# EAGLE design SaLFrostburn (EAGLE 7.5.0)
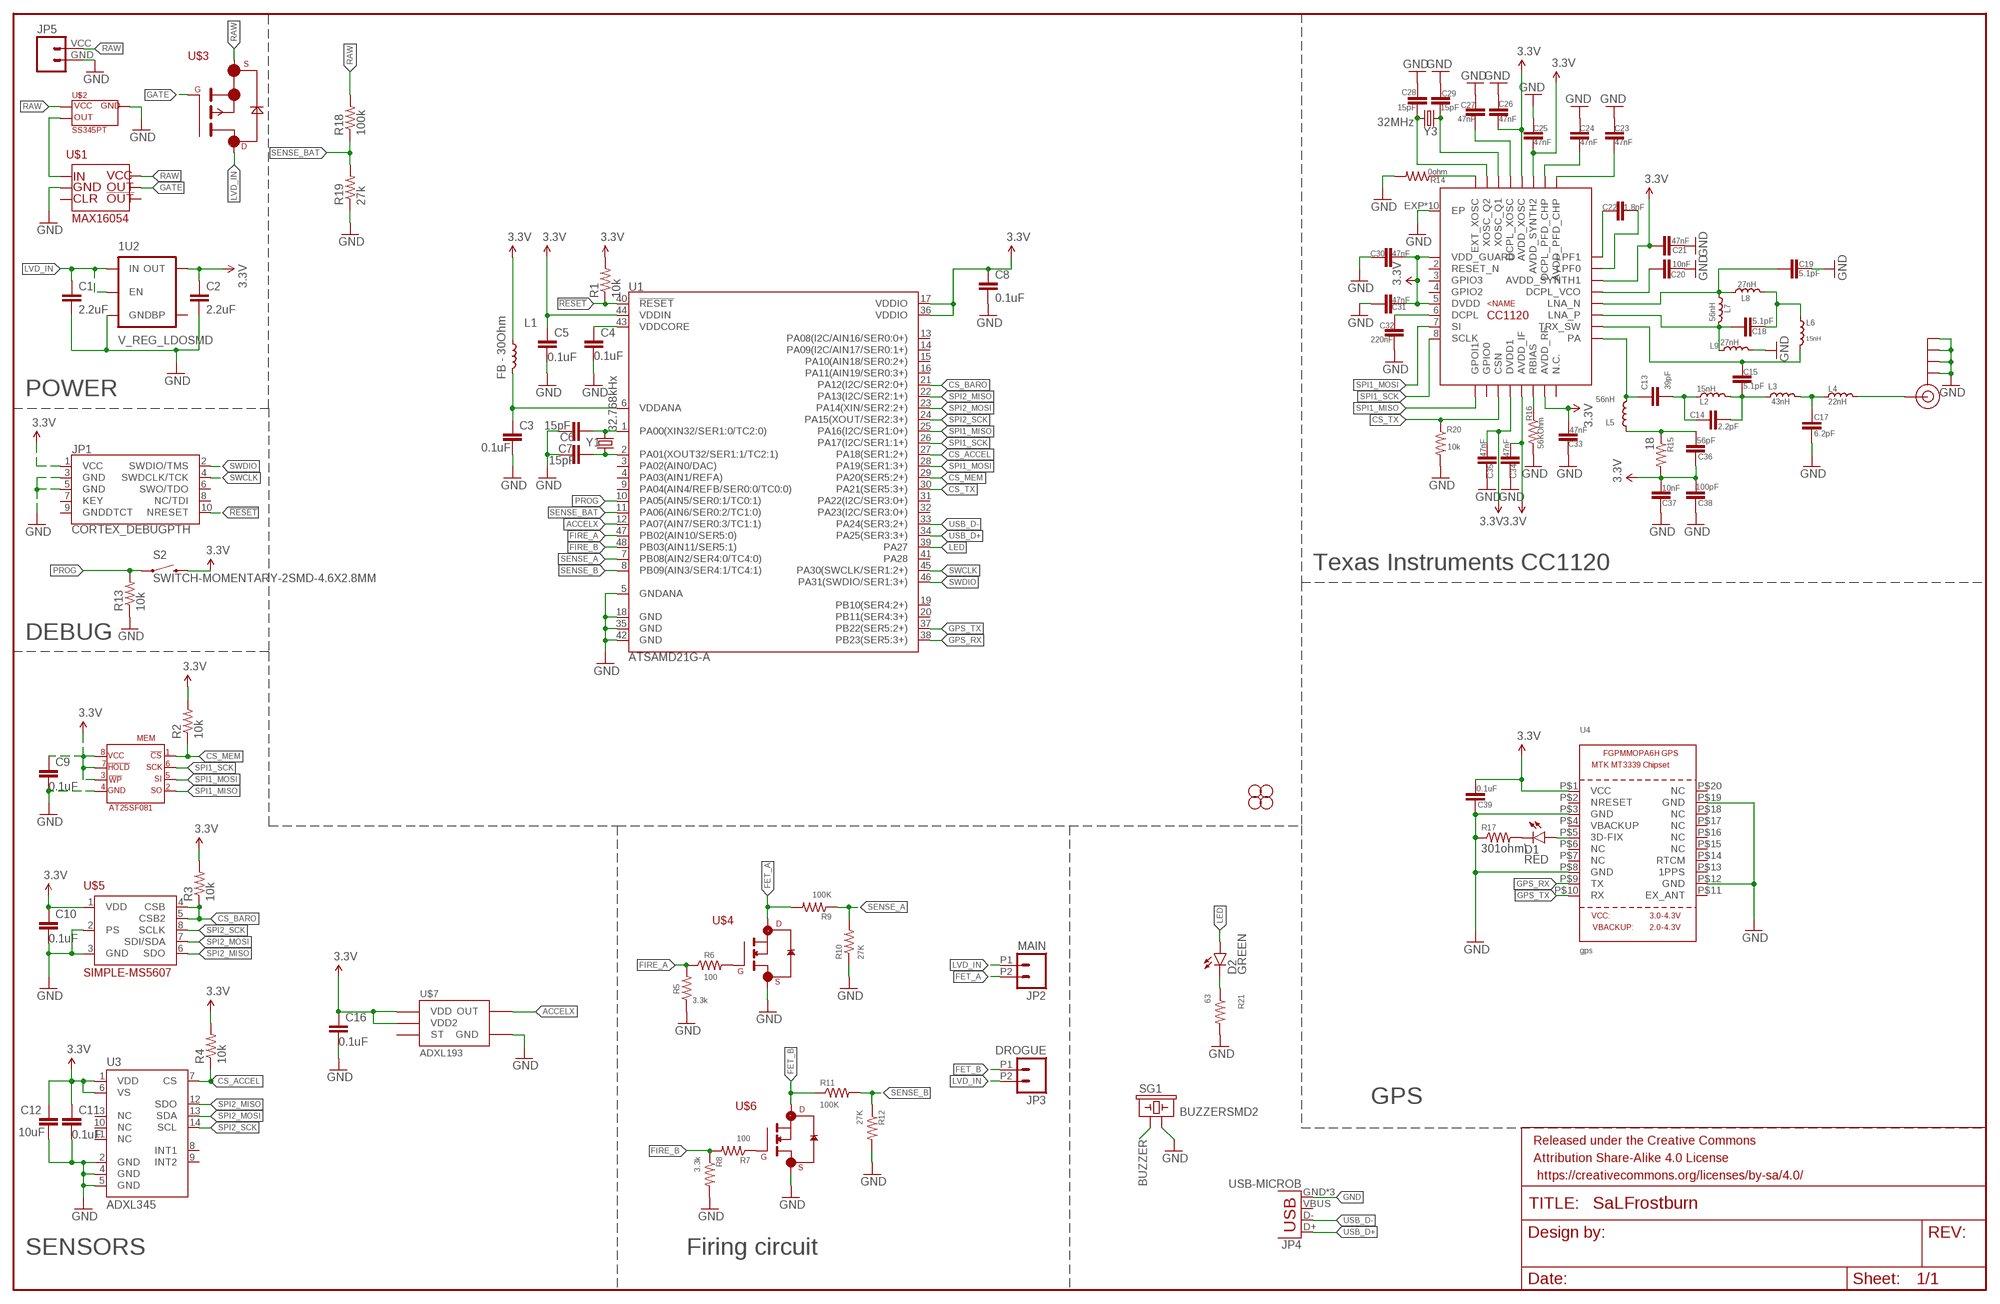
[diagram p0: schematic, sheet 1]

## Parts
1U2  V_REG_LDOSMD  [SOT23-5]
C1  2.2uF  CAP0603-CAP  [0603-CAP]
C2  2.2uF  CAP0603-CAP  [0603-CAP]
C3  0.1uF  CAP0402-CAP  [0402-CAP]
C4  0.1uF  CAP0402-CAP  [0402-CAP]
C5  0.1uF  CAP0402-CAP  [0402-CAP]
C6  15pF  CAP0402-CAP  [0402-CAP]
C7  15pF  CAP0402-CAP  [0402-CAP]
C8  0.1uF  CAP0402-CAP  [0402-CAP]
C9  0.1uF  CAP0402-CAP  [0402-CAP]
C10  0.1uF  CAP0402-CAP  [0402-CAP]
C11  0.1uF  CAP0402-CAP  [0402-CAP]
C12  10uF  CAP0402-CAP  [0402-CAP]
C13  39pF  CAP0402-CAP  [0402-CAP]
C14  2.2pF  CAP0402-CAP  [0402-CAP]
C15  5.1pF  CAP0402-CAP  [0402-CAP]
C16  0.1uF  CAP0402-CAP  [0402-CAP]
C17  6.2pF  CAP0402-CAP  [0402-CAP]
C18  5.1pF  CAP0402-CAP  [0402-CAP]
C19  5.1pF  CAP0402-CAP  [0402-CAP]
C20  10nF  CAP0402-CAP  [0402-CAP]
C21  47nF  CAP0402-CAP  [0402-CAP]
C22  1.8nF  CAP0402-CAP  [0402-CAP]
C23  47nF  CAP0402-CAP  [0402-CAP]
C24  47nF  CAP0402-CAP  [0402-CAP]
C25  47nF  CAP0402-CAP  [0402-CAP]
C26  47nF  CAP0402-CAP  [0402-CAP]
C27  47nF  CAP0402-CAP  [0402-CAP]
C28  15pF  CAP0402-CAP  [0402-CAP]
C29  15pF  CAP0402-CAP  [0402-CAP]
C30  47nF  CAP0402-CAP  [0402-CAP]
C31  47nF  CAP0402-CAP  [0402-CAP]
C32  220nF  CAP0402-CAP  [0402-CAP]
C33  47nF  CAP0402-CAP  [0402-CAP]
C34  47nF  CAP0402-CAP  [0402-CAP]
C35  47nF  CAP0402-CAP  [0402-CAP]
C36  56pF  CAP0402-CAP  [0402-CAP]
C37  10nF  CAP0402-CAP  [0402-CAP]
C38  100pF  CAP0402-CAP  [0402-CAP]
C39  0.1uF  CAP0402-CAP  [0402-CAP]
D1  RED  LED-RED0603  [LED-0603]
D2  GREEN  LED-GREEN1206  [LED-1206]
FRAME1  FRAME-LEDGER  [CREATIVE_COMMONS]
J$1  SMA_EDGE  [SMA-EDGE]
JP1  CORTEX_DEBUGPTH  [2X5-PTH-1.27MM]
JP2  MAIN  M022.54MM_SCREWTERM  [1X02_2.54_SCREWTERM]
JP3  DROGUE  M022.54MM_SCREWTERM  [1X02_2.54_SCREWTERM]
JP4  USB-MICROB  [USB-MICROB]
JP5  M024UCON-15767  [JST-2-SMD-VERT]
L1  FB - 30Ohm  INDUCTOR0603  [0603]
L2  15nH  INDUCTOR0402  [C0402]
L3  43nH  INDUCTOR0402  [C0402]
L4  22nH  INDUCTOR0402  [C0402]
L5  56nH  INDUCTOR0402  [C0402]
L6  15nH  INDUCTOR0402  [C0402]
L7  56nH  INDUCTOR0402  [C0402]
L8  27nH  INDUCTOR0402  [C0402]
L9  27nH  INDUCTOR0402  [C0402]
MEM  AT25SF081  [AT25SF081]
R1  10k  RESISTOR0402-RES  [0402-RES]
R2  10k  RESISTOR0402-RES  [0402-RES]
R3  10k  RESISTOR0402-RES  [0402-RES]
R4  10k  RESISTOR0402-RES  [0402-RES]
R5  3.3k  RESISTOR0402  [0402-RES]
R6  100  RESISTOR0402  [0402-RES]
R7  100  RESISTOR0402  [0402-RES]
R8  3.3k  RESISTOR0402  [0402-RES]
R9  100K  RESISTOR0402  [0402-RES]
R10  27K  RESISTOR0402  [0402-RES]
R11  100K  RESISTOR0402  [0402-RES]
R12  27K  RESISTOR0402  [0402-RES]
R13  10k  RESISTOR0402-RES  [0402-RES]
R14  0ohm  RESISTOR0402-RES  [0402-RES]
R15  18  RESISTOR0402-RES  [0402-RES]
R16  56KOhm  RESISTOR0402-RES  [0402-RES]
R17  301ohm\  RESISTOR0402-RES  [0402-RES]
R18  100k  RESISTOR0402-RES  [0402-RES]
R19  27k  RESISTOR0402-RES  [0402-RES]
R20  10k  RESISTOR0402-RES  [0402-RES]
R21  63  RESISTOR0402  [0402-RES]
S2  SWITCH-MOMENTARY-2SMD-4.6X2.8MM  [TACTILE_SWITCH_SMD_4.6X2.8MM]
SG1  BUZZERSMD2  [BUZZER-CCV]
STANDOFF1  STAND-OFF  [STAND-OFF]
STANDOFF2  STAND-OFF  [STAND-OFF]
STANDOFF3  STAND-OFF  [STAND-OFF]
STANDOFF4  STAND-OFF  [STAND-OFF]
TX/RX  CC1120  [CC1120]
U1  ATSAMD21G-A  [TQFP-48]
U3  ADXL345  [LGA14]
U4  gps  GPS_FGPMMOPA6H  [FGPMMOPA6H]
U$1  MAX16054  [MAX16054]
U$2  SS345PT  [SS345PT]
U$3  SI7615ADN  [SI7615ADN]
U$4  SIS410DN  [POWERPACK1212-8]
U$5  SIMPLE-MS5607  [MS5607]
U$6  SIS410DN  [POWERPACK1212-8]
U$7  ADXL193  [ADXL193]
Y1  32.768kHx  CRYSTAL3.2X1.5MM  [CRYSTAL-SMD-3.2X1.5MM]
Y3  32MHz  CRYSTAL5X3  [CRYSTAL-SMD-5X3]

## Nets
3.3V: 1U2.5(OUT) C2.1 C5.1 C8.1 C9.1 C10.1 C11.1 C12.1 C16.1 C21.1 C25.2 C26.2 C30.2 C31.2 C33.2 C34.2 C35.2 C36.1 C37.2 C38.2 C39.2 JP1.1(VCC) L1.1 MEM.!HOLD MEM.!WP MEM.VCC R1.2 R2.2 R3.2 R4.2 R15.2 S2.3 S2.4 TX/RX.1(VDD_GUARD) TX/RX.5(DVDD) TX/RX.12(DVDD1) TX/RX.13(AVDD_IF) TX/RX.15(AVDD_RF) TX/RX.22(AVDD_SYNTH1) TX/RX.27(AVDD_SYNTH2) TX/RX.28(AVDD_XOSC) U1.17(VDDIO) U1.36(VDDIO) U1.44(VDDIN) U3.1(VDD) U3.6(VS) U4.P$1(VCC) U$5.1(VDD) U$7.P$7(VDD) U$7.P$8(VDD2)
!RESET: JP1.10(NRESET) R1.1 U1.40(!RESET!)
ACCELX: U1.12(PA07(AIN7/SER0:3/TC1:1)) U$7.P$6(OUT)
BUZZER: SG1.+
CS_ACCEL: R4.1 U1.27(PA18(SER1:2+)) U3.7(CS)
CS_BARO: R3.1 U1.21(PA12(I2C/SER2:0+)) U$5.4(CSB) U$5.5(CSB2)
CS_MEM: MEM.!CS R2.1 U1.29(PA20(SER5:2+))
CS_TX: R20.1 TX/RX.11(CSN) U1.30(PA21(SER5:3+))
FET_A: JP2.P2 R9.2 U$4.5(D) U$4.6(D) U$4.7(D) U$4.8(D)
FET_B: JP3.P1 R11.1 U$6.5(D) U$6.6(D) U$6.7(D) U$6.8(D)
FIRE_A: R5.2 R6.1 U1.47(PB02(AIN10/SER5:0))
FIRE_B: R7.2 R8.1 U1.48(PB03(AIN11/SER5:1))
GATE: U$1.OUT U$3.G
GND: 1U2.2(GND) C1.2 C2.2 C3.2 C4.2 C5.2 C6.2 C7.2 C8.2 C9.2 C10.2 C11.2 C12.2 C16.2 C17.2 C19.2 C20.2 C21.2 C23.1 C24.1 C25.1 C26.1 C27.1 C28.1 C29.1 C30.1 C31.1 C32.1 C33.1 C34.1 C35.1 C37.1 C38.1 C39.1 J$1.GND@0(GND) J$1.GND@1(GND) J$1.GND@2(GND) J$1.GND@3(GND) JP1.3(GND) JP1.5(GND) JP4.GND JP4.MT1(GND) JP4.MT2(GND) JP5.GND L9.2 MEM.GND R5.1 R8.2 R10.1 R12.2 R13.1 R14.2 R16.2 R17.1 R19.1 R20.2 R21.2 SG1.- TX/RX.EXP(EP) TX/RX.EXP@1(EP) TX/RX.EXP@2(EP) TX/RX.EXP@3(EP) TX/RX.EXP@4(EP) TX/RX.EXP@5(EP) TX/RX.EXP@6(EP) TX/RX.EXP@7(EP) TX/RX.EXP@8(EP) TX/RX.EXP@9(EP) U1.5(GNDANA) U1.18(GND) U1.35(GND) U1.42(GND) U3.2(GND) U3.4(GND) U3.5(GND) U4.P$3(GND) U4.P$8(GND) U4.P$12(GND) U4.P$19(GND) U$1.GND U$2.GND U$4.1(S) U$4.2(S) U$4.3(S) U$5.2(PS) U$5.3(GND) U$6.1(S) U$6.2(S) U$6.3(S) U$7.P$3(GND)
GPS_RX: U1.38(PB23(SER5:3+)) U4.P$9(TX)
GPS_TX: U1.37(PB22(SER5:2+)) U4.P$10(RX)
LED: D2.A U1.39(PA27)
LVD_IN: 1U2.1(IN) 1U2.3(EN) C1.1 JP2.P1 JP3.P2 U$3.D1(D) U$3.D2(D) U$3.D3(D) U$3.D4(D)
N$1: R6.2 U$4.4(G)
N$2: U$1.IN U$2.OUT
N$3: C6.1 U1.1(PA00(XIN32/SER1:0/TC2:0)) Y1.P$2
N$4: C7.1 U1.2(PA01(XOUT32/SER1:1/TC2:1)) Y1.P$1
N$5: C3.1 L1.2 U1.6(VDDANA)
N$6: C4.1 U1.43(VDDCORE)
N$8: R7.1 U$6.4(G)
N$9: C13.1 L5.2 TX/RX.17(PA)
N$10: C13.2 C14.1 L2.1
N$11: C14.2 C15.1 L2.2 L3.1
N$12: C17.1 L3.2 L4.1
N$13: J$1.SIG(SIGNAL) L4.2
N$15: C23.2 TX/RX.25(AVDD_PFD_CHP)
N$16: C15.2 L6.2 TX/RX.18(TRX_SW)
N$17: C18.1 L7.2 L9.1 TX/RX.19(LNA_P)
N$18: C18.2 L6.1 L8.2
N$19: C19.1 L7.1 L8.1 TX/RX.20(LNA_N)
N$20: C22.1 TX/RX.24(LPF1)
N$21: C22.2 TX/RX.23(LPF0)
N$22: C20.1 TX/RX.21(DCPL_VCO)
N$23: C24.2 TX/RX.26(DCPL_PFD_CHP)
N$24: R16.1 TX/RX.14(RBIAS)
N$25: R14.1 TX/RX.32(EXT_XOSC)
N$26: C27.2 TX/RX.29(DCPL_XOSC)
N$27: C29.2 TX/RX.30(XOSC_Q1) Y3.3
N$28: C28.2 TX/RX.31(XOSC_Q2) Y3.1
N$29: D2.C R21.1
N$30: D1.C R17.2
N$31: D1.A U4.P$5(3D-FIX)
N$34: C32.2 TX/RX.6(DCPL)
N$38: C36.2 L5.1 R15.1
PROG: R13.2 S2.1 S2.2 U1.10(PA05(AIN5/SER0:1/TC0:1))
RAW: JP5.VCC R18.2 U$1.VCC U$2.VCC U$3.S1(S) U$3.S2(S) U$3.S3(S)
SENSE_A: R9.1 R10.2 U1.7(PB08(AIN2/SER4:0/TC4:0))
SENSE_B: R11.2 R12.1 U1.8(PB09(AIN3/SER4:1/TC4:1))
SENSE_BAT: R18.1 R19.2 U1.11(PA06(AIN6/SER0:2/TC1:0))
SPI1_MISO: MEM.SO TX/RX.9(GPOI1) U1.25(PA16(I2C/SER1:0+))
SPI1_MOSI: MEM.SI TX/RX.7(SI) U1.28(PA19(SER1:3+))
SPI1_SCK: MEM.SCK TX/RX.8(SCLK) U1.26(PA17(I2C/SER1:1+))
SPI2_MISO: U1.22(PA13(I2C/SER2:1+)) U3.12(SDO) U$5.6(SDO)
SPI2_MOSI: U1.23(PA14(XIN/SER2:2+)) U3.13(SDA) U$5.7(SDI/SDA)
SPI2_SCK: U1.24(PA15(XOUT/SER2:3+)) U3.14(SCL) U$5.8(SCLK)
SWCLK: JP1.4(SWDCLK/TCK) U1.45(PA30(SWCLK/SER1:2+))
SWDIO: JP1.2(SWDIO/TMS) U1.46(PA31(SWDIO/SER1:3+))
USB_D+: JP4.D+ U1.34(PA25(SER3:3+))
USB_D-: JP4.D- U1.33(PA24(SER3:2+))
Unconnected: 1U2.4(BP) JP1.6(SWO/TDO) JP1.7(KEY) JP1.8(NC/TDI) JP1.9(GNDDTCT) JP4.VBUS TX/RX.2(RESET_N) TX/RX.3(GPIO3) TX/RX.4(GPIO2) TX/RX.10(GPIO0) TX/RX.16(N.C.) U1.3(PA02(AIN0/DAC)) U1.4(PA03(AIN1/REFA)) U1.9(PA04(AIN4/REFB/SER0:0/TC0:0)) U1.13(PA08(I2C/AIN16/SER0:0+)) U1.14(PA09(I2C/AIN17/SER0:1+)) U1.15(PA10(AIN18/SER0:2+)) U1.16(PA11(AIN19/SER0:3+)) U1.19(PB10(SER4:2+)) U1.20(PB11(SER4:3+)) U1.31(PA22(I2C/SER3:0+)) U1.32(PA23(I2C/SER3:0+)) U1.41(PA28) U3.3(NC) U3.8(INT1) U3.9(INT2) U3.10(NC) U3.11(NC) U4.P$2(NRESET) U4.P$4(VBACKUP) U4.P$6(NC) U4.P$7(NC) U4.P$11(EX_ANT) U4.P$13(1PPS) U4.P$14(RTCM) U4.P$15(NC) U4.P$16(NC) U4.P$17(NC) U4.P$18(NC) U4.P$20(NC) U$1.!OUT U$1.CLR U$7.P$4(ST)

## Notes on the sheet
- POWER
- Texas Instruments CC1120
- DEBUG
- GPS
- SENSORS | Firing circuit

## Library data of the parts
1U2 = SparkFun-PowerIC:V_REG_LDO: Voltage Regulator LDO Standard 150mA LDO voltage regulator in SOT-23 layout. Micrel part MIC5205. BP (by-pass) pin is used to lower output noise with 470pF cap.
C1 C2 C13-C15 C17-C39 = SparkFun-Capacitors:CAP: Capacitor Standard 0603 ceramic capacitor, and 0.1" leaded capacitor.
C3-C12 C16 = SparkFun-Passives:CAP: Capacitor Standard 0603 ceramic capacitor, and 0.1" leaded capacitor.
D1 = SparkFun-LED:LED-RED: Assorted Red LEDs LilyPad 1206- DIO-09912 1206- DIO-00809 0603- DIO-00819 "SMART" means more efficient and expensive; PROD_ID: DIO-00819
D2 = SparkFun-LED:LED-GREEN: Various green LEDs Green LEDs used in SFE Production 0603- DIO-00821 LARGE- DIO-00862 LILYPAD- DIO-09910; PROD_ID: DIO-00862
FRAME1 = SparkFun-Aesthetics:FRAME-LEDGER: Schematic Frame Standard 11x14 US Ledger frame
J$1 = SparkFun-Connectors:SMA_EDGE: SMA Antenna Connector End launch SMA connector. The paste layer has been removed so that the connector can be hand soldered onto the board after reflow.
JP1 = SparkFun-Connectors:CORTEX_DEBUG: Cortex Debug Connector Datasheet <http://infocenter.arm.com/help/topic/com.arm.doc.faqs/attached/13634/cortex_debug_connectors.pdf>
JP2 JP3 JP5 = SparkFun-Connectors:M02: Standard 2-pin 0.1" header. Use with - straight break away headers ( PRT-00116) - right angle break away headers (PRT-00553) - swiss pins (PRT-00743) - machine pins (PRT-00117) - female headers (PRT-00115) Molex polarized connector foot print use with: PRT-08233 with associated crimp pins and housings. 2.54_SCREWTERM for use with PRT-10571. 3.5mm Screw Terminal footprints for PRT-08084 5mm Screw Terminal footprints for use with PRT-08432
JP4 = SparkFun-Connectors:USB: USB Connectors USB-B-PTH is fully proven SKU : PRT-00139/CONN-08278 USB-miniB is fully proven SKU : PRT-00587 USB-A-PCB is untested. USB-A-H is throughly reviewed, but untested. Spark Fun Electronics SKU : PRT-00437 USB-B-SMT is throughly reviewed, but untested. Needs silkscreen touching up. USB-A-S has not been used/tested USB-MB-H has not been used/tested USB-MICROB has been used. CONN-09505; PROD_ID: CONN-09505
L1-L9 = SparkFun-Passives:INDUCTOR: Inductors Basic Inductor/Choke - 0603 and 1206. Footprints are not proven and vary greatly between part numbers. INDUCTOR POWER 3.3UH 4.0A SMD 0.197" L x 0.197" W x 0.177" H (5.00mm x 5.00mm x 4.50mm)
MEM = SaL-lib:AT25SF081: AT25SF081 - 8M memory smd
R1-R4 R13-R20 = SparkFun-Passives:RESISTOR: Resistor Basic schematic elements and footprints for 0603, 1206, and PTH resistors.
R5-R12 R21 = SparkFun-Resistors:RESISTOR: Resistor Basic schematic elements and footprints for 0603, 1206, and PTH resistors.
S2 = SparkFun-Electromechanical:SWITCH-MOMENTARY-2: Various NO switches- pushbuttons, reed, etc; PROD_ID: SWCH-13065
SG1 = SparkFun-Electromechanical:BUZZER: Buzzer 12mm Spark Fun Electronics SKU : Comp-Buzzer
STANDOFF1-STANDOFF4 = SparkFun-Electromechanical:STAND-OFF: #4 Stand Off This is the mechanical footprint for a #4 phillips button head screw. Use the keepout ring to avoid running the screw head into surrounding components. SKU : PRT-00447
TX/RX = SaL-lib:CC1120
U1 = SparkFun-DigitalIC:ATSAMD21G: Atmel SAMD21G SMART ARM-Based Microcontroller The Atmel ® | SMART ™ SAM D21 is a series of low-power microcontrollers using the 32-bit ARM ® Cortex ® -M0+ processor, and ranging from 32- to 64-pins with up to 256KB Flash and 32KB of SRAM. The SAM D21 devices operate at a maximum frequency of 48MHz and reach 2.46 CoreMark/MHz. They are designed for simple and intuitive migration with identical peripheral modules, hex compatible code, identical linear address map and pin compatible migration paths between all devices in the product series. All devices include intelligent and flexible peripherals, Atmel Event System for inter-peripheral signaling, and support for capacitive touch button, slider and wheel user interfaces.; PROD_ID: IC-13064
U3 = SparkFun-Sensors:ADXL345: 3-axis SPI/I2C 2/4/8/16g accelerometer
U4 = adafruit:GPS_FGPMMOPA6H: GPS Module - MTK MT3339 Chipset, -165dBm sensitivity, 22 channels, 10Hz, auto-select external antenna options
U$1 = SaL-lib:MAX16054
U$2 = SaL-lib:SS345PT
U$3 = SaL-lib:SI7615ADN
U$4 U$6 = SaL-lib1:SIS410DN
U$5 = MS5607:SIMPLE
U$7 = SparkFun-Sensors:ADXL193: 250g accelerometer analog out
Y1 = SparkFun-FreqCtrl:CRYSTAL: Various standard crystals. Proven footprints.
Y3 = SparkFun-FreqCtrl:CRYSTAL: Various standard crystals. Proven footprints.; PROD_ID: XTAL-08218

## Board
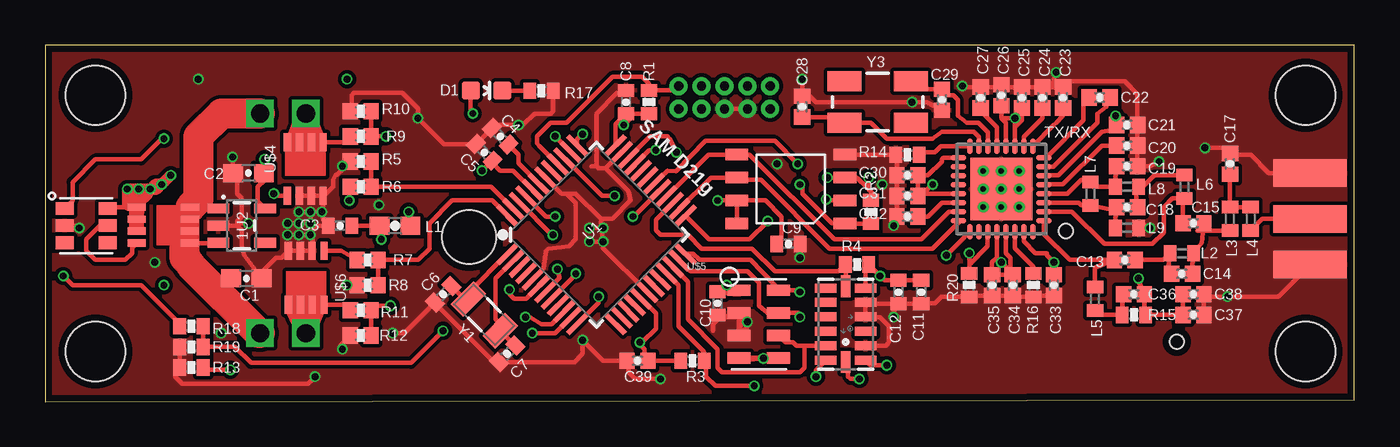
[diagram p1: board, top side]
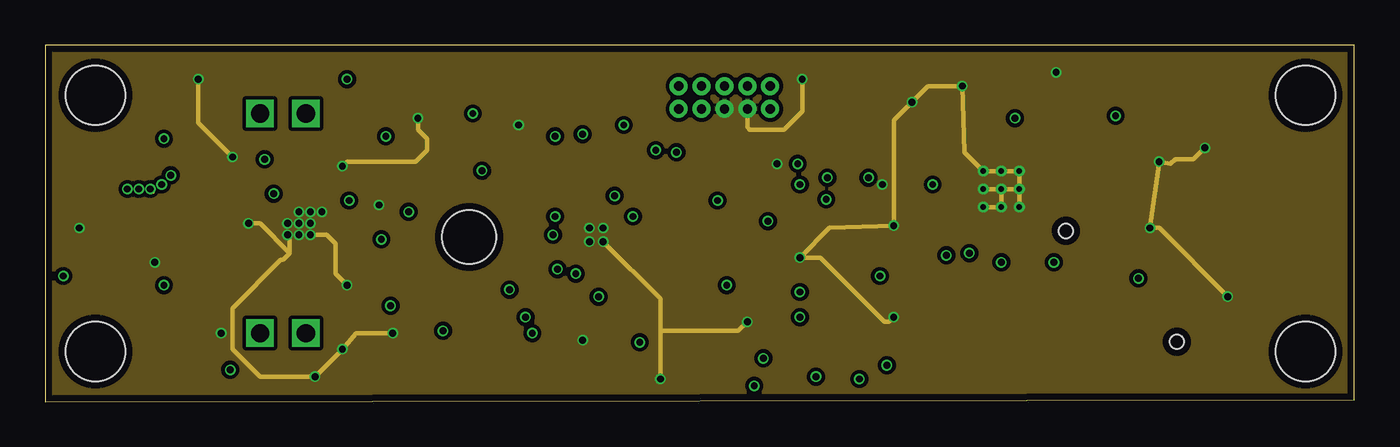
[diagram p2: board, inner layer Route2]
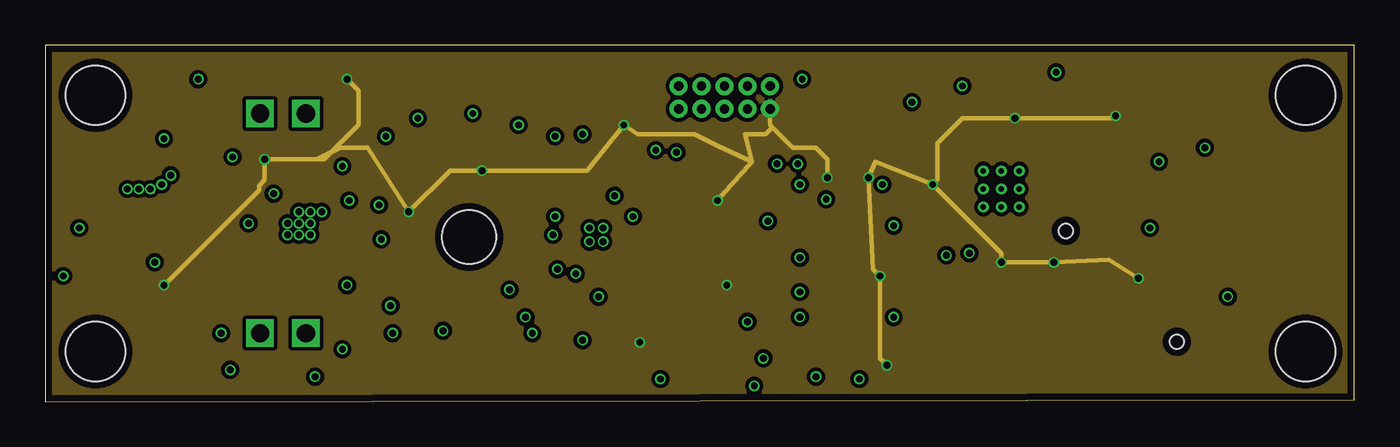
[diagram p3: board, inner layer Route15]
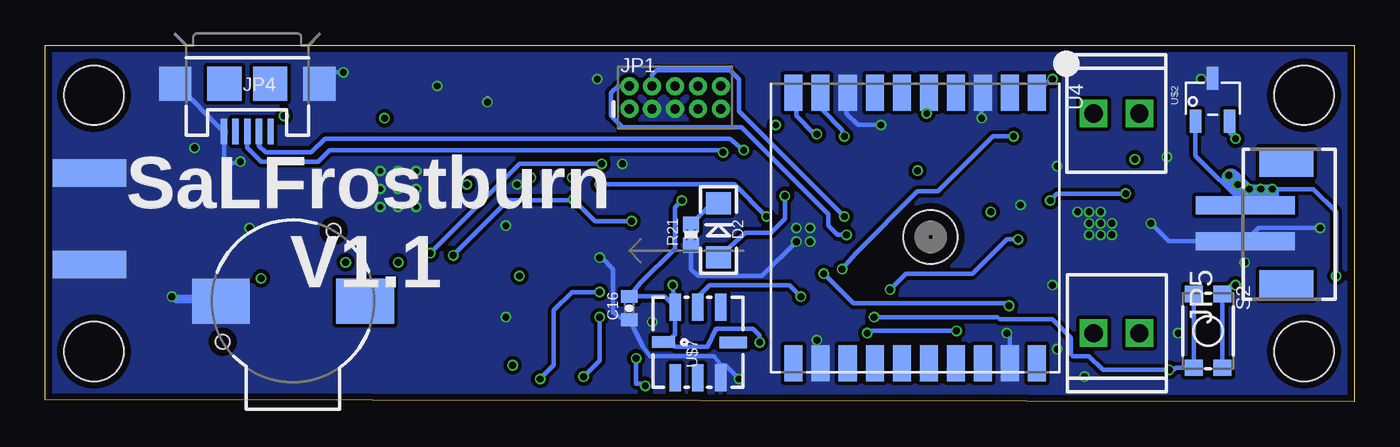
[diagram p4: board, bottom side, seen from below]

Size 72.69 x 19.8 mm. Coordinates in mm from the lower left corner, seen from the top.
Outline: 0,0 72.69,0.13 72.69,19.8 0,19.8 0,0
Copper layers (1*2*15*16): Top 0.035559375mm / dielectric 0.17018125mm / Route2 0.01778125mm / dielectric 47mil / Route15 0.01778125mm / dielectric 0.17018125mm / Bottom 0.035559375mm
Design rules "OSHPark-4layer-SaL *": minimum track width 5mil, minimum drill 10mil, track to track 8mil, track to pad 8mil, pad to pad 8mil, via to via 10mil, smd to smd 0mil, copper to edge 15mil, drill to drill 6mil, minimum pad ring 4mil, minimum via ring 4mil, stop-mask expansion 0mil, vias tented up to drill 20mil, thermal gap 0mil

### Footprints (pad centres in the part's own frame; a part is rotated, then mirrored left to right if it is on the bottom)
SOT23-5 = smd 0.55 x 1.2: 1 -0.95,-1.3; 2 0,-1.3; 3 0.95,-1.3; 4 0.95,1.3; 5 -0.95,1.3
0603-CAP = smd 1.1 x 1: 1 -0.85,0; 2 0.85,0
0402-CAP = smd 0.7 x 0.9: 1 -0.65,0; 2 0.65,0
0402-CAP' = smd 0.85 x 0.9: 1 -0.58,0; 2 0.58,0
LED-0603 = smd 1 x 1: A 0,-0.877; C 0,0.877
LED-1206 = smd 1.2 x 1.4: A -1.5,0; C 1.5,0
SMA-EDGE = smd 1.524 x 4.064: GND@0 0,0; GND@1 5.08,0; SIG 2.54,0 | smd 1.524 x 4.064 bottom: GND@2 0,0; GND@3 5.08,0
2X5-PTH-1.27MM = drill 0.508 pad 1: 1 -2.54,-0.635; 2 -2.54,0.635; 3 -1.27,-0.635; 4 -1.27,0.635; 5 0,-0.635; 6 0,0.635; 7 1.27,-0.635; 8 1.27,0.635; 9 2.54,-0.635; 10 2.54,0.635
1X02_2.54_SCREWTERM = drill 1.016 square: P1 2.54,0; P2 0,0
USB-MICROB = smd 0.35 x 1.4: D+ 0,2.65; D- -0.65,2.65; GND 1.3,2.65; ID 0.65,2.65; VBUS -1.3,2.65 | smd 1.8 x 1.9: MT1 -4,0; MT2 4,0 | smd 1.9 x 1.9: P$1 -1.27,0; P$2 1.27,0
JST-2-SMD-VERT = smd 1 x 5.5: GND 1,-2; VCC -1,-2 | smd 1.6 x 3: P$1 -3.4,0.27; P$2 3.4,0.27
0603 = smd 1.1 x 1: 1 -0.85,0; 2 0.85,0
C0402 = smd 0.7 x 0.9: 1 -0.65,0; 2 0.65,0
AT25SF081 = smd 1.27 x 0.635: !CS -3,2.54; !HOLD 3,1.27; !WP -3,0; GND -3,-1.27; SCK 3,0; SI 3,-1.27; SO -3,1.27; VCC 3,2.54
0402-RES = smd 0.7 x 0.9: 1 -0.65,0; 2 0.65,0
0402-RES' = smd 0.85 x 0.9: 1 -0.58,0; 2 0.58,0
TACTILE_SWITCH_SMD_4.6X2.8MM = smd 0.9 x 1: 1 -2.05,-0.8; 2 2.05,-0.8; 3 2.05,0.8; 4 -2.05,0.8
BUZZER-CCV = smd 3.2 x 2.5: + 4,0; - -4,0 | hole 0.8: -3.9,-2.25; 2.25,3.9
STAND-OFF = hole 3.302: 0,0
CC1120 = smd 0.85 x 0.3: 1 -2.375,1.75; 2 -2.375,1.25; 3 -2.375,0.75; 4 -2.375,0.25; 5 -2.375,-0.25; 6 -2.375,-0.75; 7 -2.375,-1.25; 8 -2.375,-1.75; 17 2.375,-1.75; 18 2.375,-1.25; 19 2.375,-0.75; 20 2.375,-0.25; 21 2.375,0.25; 22 2.375,0.75; 23 2.375,1.25; 24 2.375,1.75 | smd 0.3 x 0.85: 9 -1.75,-2.375; 10 -1.25,-2.375; 11 -0.75,-2.375; 12 -0.25,-2.375; 13 0.25,-2.375; 14 0.75,-2.375; 15 1.25,-2.375; 16 1.75,-2.375; 25 1.75,2.375; 26 1.25,2.375; 27 0.75,2.375; 28 0.25,2.375; 29 -0.25,2.375; 30 -0.75,2.375; 31 -1.25,2.375; 32 -1.75,2.375 | smd 3.45 x 3.45: EXP 0,0 | drill 0.3 pad 0.6: EXP@1 -1,1; EXP@2 0,1; EXP@3 1,1; EXP@4 -1,0; EXP@5 0,0; EXP@6 1,0; EXP@7 -1,-1; EXP@8 0,-1; EXP@9 1,-1
TQFP-48 = smd 1.5 x 0.28: 1 -4.25,2.75; 2 -4.25,2.25; 3 -4.25,1.75; 4 -4.25,1.25; 5 -4.25,0.75; 6 -4.25,0.25; 7 -4.25,-0.25; 8 -4.25,-0.75; 9 -4.25,-1.25; 10 -4.25,-1.75; 11 -4.25,-2.25; 12 -4.25,-2.75; 25 4.25,-2.75; 26 4.25,-2.25; 27 4.25,-1.75; 28 4.25,-1.25; 29 4.25,-0.75; 30 4.25,-0.25; 31 4.25,0.25; 32 4.25,0.75; 33 4.25,1.25; 34 4.25,1.75; 35 4.25,2.25; 36 4.25,2.75 | smd 0.28 x 1.5: 13 -2.75,-4.25; 14 -2.25,-4.25; 15 -1.75,-4.25; 16 -1.25,-4.25; 17 -0.75,-4.25; 18 -0.25,-4.25; 19 0.25,-4.25; 20 0.75,-4.25; 21 1.25,-4.25; 22 1.75,-4.25; 23 2.25,-4.25; 24 2.75,-4.25; 37 2.75,4.25; 38 2.25,4.25; 39 1.75,4.25; 40 1.25,4.25; 41 0.75,4.25; 42 0.25,4.25; 43 -0.25,4.25; 44 -0.75,4.25; 45 -1.25,4.25; 46 -1.75,4.25; 47 -2.25,4.25; 48 -2.75,4.25
LGA14 = smd 0.5 x 1.2: 1 2,1.1; 2 1.2,1.1; 3 0.4,1.1; 4 -0.4,1.1; 5 -1.2,1.1; 6 -2,1.1; 8 -2,-1.1; 9 -1.2,-1.1; 10 -0.4,-1.1; 11 0.4,-1.1; 12 1.2,-1.1; 13 2,-1.1 | smd 1.2 x 0.5: 7 -2.1,0; 14 2.1,0
FGPMMOPA6H = smd 2 x 1: P$1 -7.5,6.75; P$2 -7.5,5.25; P$3 -7.5,3.75; P$4 -7.5,2.25; P$5 -7.5,0.75; P$6 -7.5,-0.75; P$7 -7.5,-2.25; P$8 -7.5,-3.75; P$9 -7.5,-5.25; P$10 -7.5,-6.75; P$11 7.5,-6.75; P$12 7.5,-5.25; P$13 7.5,-3.75; P$14 7.5,-2.25; P$15 7.5,-0.75; P$16 7.5,0.75; P$17 7.5,2.25; P$18 7.5,3.75; P$19 7.5,5.25; P$20 7.5,6.75 | hole 3: 0.5,0.85
MAX16054 = smd 1 x 0.7: !OUT 1.2,-0.95; CLR -1.2,-0.95; GND -1.2,0; IN -1.2,0.95; OUT 1.2,0; VCC 1.2,0.95
SS345PT = smd 1.27 x 0.635: GND 1.2,0; OUT -1.2,-0.95; VCC -1.2,0.95
SI7615ADN = smd 0.99 x 0.405: D1 2.985,0; D2 2.985,-0.66; D3 2.985,-1.32; D4 2.985,-1.98; G 0,-1.98; S1 0,0; S2 0,-0.66; S3 0,-1.32
POWERPACK1212-8 = smd 0.99 x 0.405: 1 0,-1.98; 2 0,-1.32; 3 0,-0.66; 4 0,0; 5 2.985,0; 6 2.985,-0.66; 7 2.985,-1.32; 8 2.985,-1.98
MS5607 = smd 1.27 x 0.635: 1 -1.1,1.875; 2 -1.1,0.625; 3 -1.1,-0.625; 4 -1.1,-1.875; 5 1.1,-1.875; 6 1.1,-0.625; 7 1.1,0.625; 8 1.1,1.875
ADXL193 = smd 1.5 x 0.64: P$1 -1.96,1.26; P$2 -1.96,0; P$3 -1.96,-1.26; P$5 1.96,-1.26; P$6 1.96,0; P$7 1.96,1.26 | smd 0.64 x 1.5: P$4 0,-1.96 | smd 0.64 x 1.27: P$8 0.01,1.9
CRYSTAL-SMD-3.2X1.5MM = smd 1 x 1.8: P$1 -1.25,0; P$2 1.25,0
CRYSTAL-SMD-5X3 = smd 1.9 x 1.1: 1 -1.85,-1.15; 2 1.85,-1.15; 3 1.85,1.15; 4 -1.85,1.15

### Placement (x,y rotation side)
1U2  10.92,9.78 270 top
C1  11.18,6.86 0 top
C2  11.3,12.7 180 top
C3  16.38,9.78 180 top
C4  25.27,14.73 135 top
C5  24.38,13.84 135 top
C6  22.1,5.97 225 top
C7  25.65,2.67 225 top
C8  32.26,16.64 90 top
C9  41.27,8.76 0 top
C10  37.34,5.46 270 top
C11  48.64,6.1 270 top
C12  47.37,6.1 270 top
C13  39pF  [0402-CAP']  59.94,7.87 0 top
C14  2.2pF  [0402-CAP']  63.12,7.11 0 top
C15  5.1pF  [0402-CAP']  63.75,9.91 180 top
C16  40.26,5.21 270 bottom
C17  6.2pF  [0402-CAP']  65.79,13.21 90 top
C18  5.1pF  [0402-CAP']  60.07,10.79 0 top
C19  5.1pF  [0402-CAP']  60.07,13.08 0 top
C20  10nF  [0402-CAP']  60.07,14.22 0 top
C21  47nF  [0402-CAP']  60.07,15.37 0 top
C22  1.8nF  [0402-CAP']  58.55,16.89 0 top
C23  47nF  [0402-CAP']  56.52,16.89 270 top
C24  47nF  [0402-CAP']  55.37,16.89 270 top
C25  47nF  [0402-CAP']  54.23,16.89 270 top
C26  47nF  [0402-CAP']  53.09,17.02 270 top
C27  47nF  [0402-CAP']  51.94,16.89 270 top
C28  15pF  [0402-CAP']  42.04,16.38 270 top
C29  15pF  [0402-CAP']  49.78,16.76 90 top
C30  47nF  [0402-CAP']  47.88,12.57 0 top
C31  47nF  [0402-CAP']  47.88,11.43 0 top
C32  220nF  [0402-CAP']  47.88,10.29 0 top
C33  47nF  [0402-CAP']  56.01,6.48 90 top
C34  47nF  [0402-CAP']  53.72,6.48 90 top
C35  47nF  [0402-CAP']  52.58,6.48 90 top
C36  56pF  [0402-CAP']  60.45,5.97 180 top
C37  10nF  [0402-CAP']  63.75,4.83 180 top
C38  100pF  [0402-CAP']  63.75,5.97 180 top
C39  0.1uF  [0402-CAP']  32.89,2.29 0 top
D1  24.51,17.27 270 top
D2  35.31,9.53 90 bottom
FRAME1  -0.38,23.62 0 top  (outside the outline)
J$1  70.23,7.62 90 top
JP1  37.72,16.89 0 bottom
JP2  14.48,16 0 bottom
JP3  11.94,3.81 180 bottom
JP4  61.47,17.65 180 bottom
JP5  4.06,9.91 270 bottom
L1  19.43,9.78 180 top
L2  63.12,8.26 0 top
L3  65.79,10.16 90 top
L4  66.93,10.16 270 top
L5  58.29,5.71 90 top
L6  63.25,11.94 270 top
L7  58.04,11.56 270 top
L8  60.07,11.94 0 top
L9  60.07,9.65 0 top
MEM  41.4,12.45 180 top
R1  33.53,16.64 270 top
R2  45.85,10.54 90 top
R3  35.94,2.29 180 top
R4  45.09,7.62 0 top
R5  3.3k  [0402-RES']  17.53,13.34 0 top
R6  100  [0402-RES']  17.53,11.94 180 top
R7  100  [0402-RES']  17.91,7.87 0 top
R8  3.3k  [0402-RES']  17.91,6.48 180 top
R9  100K  [0402-RES']  17.53,14.73 180 top
R10  27K  [0402-RES']  17.53,16.13 0 top
R11  100K  [0402-RES']  17.53,5.08 0 top
R12  27K  [0402-RES']  17.53,3.68 180 top
R13  8.13,1.91 0 top
R14  47.88,13.72 180 top
R15  60.45,4.83 0 top
R16  54.86,6.48 270 top
R17  27.56,17.27 180 top
R18  8.13,4.19 180 top
R19  8.13,3.05 0 top
R20  51.31,6.48 270 top
R21  63  [0402-RES']  36.83,9.27 270 bottom
S2  8.13,3.94 270 bottom
SG1  58.93,5.59 0 bottom
STANDOFF1  69.98,17.02 0 top
STANDOFF2  2.79,17.02 0 top
STANDOFF3  2.79,2.79 0 top
STANDOFF4  69.98,2.79 0 top
TX/RX  53.09,11.81 0 top
U1  30.61,9.27 45 top
U3  44.45,4.32 270 top
U4  24.38,9.65 270 bottom
U$1  2.29,9.78 0 top
U$2  7.87,16.76 90 bottom
U$3  5.08,10.79 0 top
U$4  13.46,11.43 90 top
U$5  39.62,4.32 0 top
U$6  15.49,8.38 270 top
U$7  36.45,3.3 90 bottom
Y1  24.38,4.83 135 top
Y3  46.23,16.64 0 top

### Tracks (layer width: path | path; a pad name or v marks a point on that pad's centre or on a via)
3.3V  (via drill 0.38)
  Top 0.254: C10.1 38.21,5.98 | U$5.1 38.57,5.98 38.21,5.98 | MEM.VCC MEM.!HOLD | TX/RX.1 49.88,13.56 49.78,13.46 49.78,13.34 49.02,12.57 C30.2 48.46,11.69 48.59,11.56 | TX/RX.5 48.59,11.56 | 48.59,11.56 C31.2 48.64,11.43 v49.28,12.07 | MEM.!HOLD 40,11.18 40.89,10.29 40.89,9.03 C9.1 | 45.72,11.81 45.66,11.88 | 45.66,11.88 45.09,12.45 MEM.!WP v43.43,12.45 | C11.1 C12.1 46.61,6.75 R4.2 | R3.2 C39.2 33.27,2.49 33.27,2.92 33.02,3.17 v33.02,3.3 33.15,3.3 33.91,4.06 33.91,4.91 U1.17 | TX/RX.12 52.84,8.01 52.58,7.75 C35.2 C34.2 | TX/RX.13 53.34,8.26 53.59,8 53.59,7.18 C34.2 | C34.2 53.72,7.11 v53.09,7.75 | C33.2 v56.01,7.75 55.63,8.13 55.63,8.26 54.99,8.26 54.34,8.91 TX/RX.15 | U3.6 45.55,7.43 R4.2 | R4.2 45.73,7.6 v46.35,6.98 | v46.74,2.03 45.84,2.03 U3.1 | C38.2 C37.2 R15.2 61.03,4.9 C36.1 60.65,6.86 v60.71,6.86 | TX/RX.22 55.47,12.57 56.26,12.57 58.67,14.99 59.31,15.11 59.31,15.19 C21.1 59.49,15.82 v59.44,15.88 59.44,15.49 | C25.2 54.23,15.62 53.84,15.23 TX/RX.27 53.84,15.74 v53.85,15.75 53.09,15.75 | TX/RX.28 53.34,15.5 53.09,15.75 | 53.09,15.75 C26.2 | MEM.!HOLD v37.34,11.18 | 38.21,5.98 v37.85,6.48 | 45.66,11.88 v45.72,12.45 45.72,11.81 | R2.2 45.97,11.56 45.72,11.81 | C8.1 R1.2 | U1.36 31.67,15.4 C8.1 | v32.13,15.37 32.51,15.73 C8.1 | U1.44 25.99,12.83 25.27,12.83 24.84,13.26 C5.1 24.81,13.38 v24.26,12.83 | 1U2.5 11.81,11.14 11.81,11.94 12.15,12.28 C2.1 12.15,13.42 v12.19,13.46 | L1.1 20.19,9.87 v20.19,10.54
  Route15 0.254: v46.74,2.03 46.35,2.41 v46.35,6.98 45.97,7.37 v45.72,12.45 46.1,13.34 v49.28,12.07 | v60.71,6.86 59.05,7.87 v56.01,7.75 v53.09,7.75 53.09,8.26 v49.28,12.07 | JP1.1 40.26,15.37 40.39,15.24 | 40.39,15.24 41.53,14.1 42.8,14.1 43.43,13.46 v43.43,12.45 | v37.34,11.18 39.24,13.34 | 39.24,13.34 38.86,14.86 40,14.86 40.39,15.24 | v49.28,12.07 49.53,12.32 49.53,14.35 50.93,15.75 v53.85,15.75 59.18,15.75 v59.44,15.88 | 39.24,13.34 37.34,14.22 36.07,14.86 32.89,14.86 v32.13,15.37 30.1,12.83 v24.26,12.83 22.48,12.83 v20.19,10.54 17.91,14.1 16.38,14.1 15.11,13.46 | 15.11,13.46 v12.19,13.46 12.19,12.32 11.88,12 11.88,11.75 v6.6,6.48 | 15.11,13.46 15.49,13.46 17.4,15.37 17.4,17.27 v16.76,17.91
  Bottom 0.254: 37.72,5.27 38.3,5.86 C16.1 39.62,6.6 37.72,8.51 37.72,10.79 v37.34,11.18 | v33.02,3.3 33.02,3.68 33.4,4.06 35.43,4.06 35.93,3.06 37.72,3.05 37.86,3.31 U$7.P$8 37.71,3.73 U$7.P$7 37.72,5.27 | v37.85,6.48 37.72,5.27 | S2.3 S2.4 6.84,6.48 v6.6,6.48 | v16.76,17.91 16.88,17.91 U4.P$1
  pour Route15: -0.38,21.72 73.28,21.72 73.28,-6.22 -0.38,-6.22
!RESET
  Top 0.254: JP1.10 34.94,17.29 R1.1 33.53,17.65 33.15,18.03 31.5,18.03 28.96,15.49 28.07,15.49 27.3,14.73 27.3,14.35 27.43,14.22 27.43,14.21 U1.40
ACCELX  (via drill 0.38)
  Top 0.254: v30.73,5.84 30.73,5.51 U1.12
  Bottom 0.254: U$7.P$6 36.45,5.84 35.81,6.48 31.37,6.48 v30.73,5.84
CS_ACCEL
  Top 0.254: U3.7 44.45,7.86 R4.1 44.05,7.24 40.51,7.24 39.24,8.51 36.45,8.51 35.69,9.27 34.16,9.27 33.91,9.53 33.91,10.1 U1.27
CS_BARO  (via drill 0.38)
  Top 0.254: U$5.5 U$5.4 38.62,2.29 v39.88,2.41 | U1.21 35.18,6.47 35.18,4.19 36.59,2.78 R3.1 36.7,2.17 36.7,1.4 37.21,0.89 v39.37,0.89
  Bottom 0.254: v39.88,2.41 39.88,1.02 39.5,1.02 v39.37,0.89
CS_MEM  (via drill 0.38)
  Top 0.254: R2.1 44.42,9.89 MEM.!CS 43.69,9.91 42.04,11.56 42.04,11.94 v41.91,12.07 | U1.29 32.68,10.29 v32.64,10.29
  Bottom 0.254: v32.64,10.29 34.42,12.07 v41.91,12.07
CS_TX  (via drill 0.38)
  Top 0.254: TX/RX.11 52.32,9.42 52.32,8.64 51.31,7.62 R20.1 v51.31,8.26 | v41.78,13.21 40.51,14.48 36.68,14.48 35.02,12.8 34.54,12.83 U1.30
  Bottom 0.254: v51.31,8.26 46.35,13.21 v41.78,13.21
FET_A
  Top 0.254: R9.2 16.63,14.42 U$4.8 U$4.7 | U$4.7 U$4.6 U$4.5 | JP2.P2 14.78,15.7 U$4.7
  Top 1.016: JP2.P2 14.48,14.35 | 14.48,14.22 14.48,14.35 | 14.48,14.35 15.11,14.35 JP2.P2 | 14.48,14.35 13.84,14.35 JP2.P2
FET_B
  Top 0.254: R11.1 16.63,5.4 U$6.5 U$6.6 | U$6.6 U$6.7 U$6.8 | JP3.P1 14.83,4.17 U$6.6
  Top 1.016: JP3.P1 14.48,5.33 | 14.48,5.33 13.84,5.33 | 14.48,5.33 15.11,5.33 JP3.P1 | 13.84,5.21 JP3.P1
FIRE_A
  Top 0.254: U1.47 24.76,11.94 R6.1 R5.2
FIRE_B
  Top 0.254: U1.48 24.81,11.18 22.61,11.18 21.34,9.91 21.34,8.51 20.7,7.87 R7.2 R8.1
GATE
  Top 0.254: U$1.OUT 3.05,9.78 2.29,9.02 2.29,8.38 2.79,7.87 4.45,7.87 4.83,8.26 4.83,8.56 U$3.G
GND  (via drill 0.38)
  Top 0.254: C10.2 38.52,4.68 | 38.52,4.68 U$5.2 U$5.3 38.61,3.78 | v34.16,1.27 32.77,1.27 32.38,1.65 32.38,2.21 C39.1 30.99,2.29 v29.84,3.43 29.84,2.67 29.38,2.21 C7.2 24.94,2.21 C6.2 19.94,3.81 v19.3,3.81 | C12.2 C11.2 48.66,5.46 49.4,5.46 49.77,5.83 R20.2 51.38,5.9 C35.1 C34.1 53.79,5.83 R16.2 54.93,5.9 C33.1 | C12.2 45.62,5.45 U3.5 U3.4 45.57,4.7 46.35,4.7 46.86,4.19 46.86,3.3 46.68,3.12 U3.2 | L9.2 60.85,9.91 v61.34,9.65 | v61.85,13.34 61.34,13.08 C19.2 C20.2 C21.2 60.65,17.07 59.94,17.78 56.57,17.78 C23.1 55.88,17.47 | C37.1 C38.1 64.46,5.84 v65.66,5.84 68.45,5.84 J$1.GND@0 | J$1.GND@1 67.95,12.7 66.93,13.72 65.86,13.72 C17.2 65.48,14.1 v64.39,14.1 | 55.88,17.47 C24.1 C25.1 53.21,17.47 C26.1 52.96,17.47 C27.1 51.11,17.47 v50.93,17.53 | v56.13,18.29 55.88,17.47 | C29.1 48.95,16.64 v48.13,16.64 42.8,16.64 42.47,16.96 C28.1 v42.04,17.91 | C9.2 41.92,8.02 v41.91,8 | v47.12,4.7 47.12,5.19 C12.2 | MEM.GND R14.2 47.3,13.65 C30.1 C31.1 C32.1 47.3,9.83 v47.12,9.78 | U1.35 31.12,12.95 | 31.12,12.95 30.73,12.95 30.61,13.08 | 30.61,13.08 30.61,16 31.75,17.14 32.12,17.14 C8.2 | JP1.5 JP1.3 | U$4.1 15.44,10.07 C3.2 15.11,9.78 14.86,9.53 14.86,8.41 U$6.3 U$6.2 U$6.1 13.13,8 12.83,8 12.03,7.2 C1.2 11.05,8.13 10.92,8.64 10.92,9.53 10.67,9.78 | R10.1 17.02,16.2 17.02,17.02 17.14,17.14 19.81,17.14 20.7,16.26 v20.7,15.75 22.15,14.3 C5.2 C4.2 24.84,15.19 25.02,15.37 v26.29,15.37 26.54,15.37 27.18,16 28.07,16 28.19,16.13 28.19,17.26 R17.1 | R12.2 16.38,3.12 v16.51,2.92 | 1U2.2 10.67,9.78 | 10.67,10.03 10.92,10.29 10.92,11.3 10.67,11.56 10.67,12.23 C2.2 10.41,12.74 v10.41,13.59
  Top 0.254: 10.67,10.03 10.67,9.78 | v11.3,9.91 10.79,9.91 10.67,10.03 | v14.1,10.54 v14.73,10.54 | v14.73,10.54 v14.73,9.91 | v14.73,9.91 v14.1,9.91 v13.46,9.91 | v14.73,9.91 v14.73,9.27 v14.1,9.27 v13.46,9.27 | v15.37,10.54 v14.73,10.54 | U$4.1 U$4.2 U$4.3 | U$1.GND 1.78,9.78 v1.9,9.65 | R19.1 R13.1 7.37,1.91 7.24,2.03 7.24,1.4 7.62,1.02 14.61,1.02 v14.99,1.4 | R8.2 v16.76,6.48 | U$4.1 15.49,11.43 16,11.94 16,12.32 16.13,12.57 16.26,12.65 R5.1 16.69,13.08 v16.51,13.08 | U1.5 27.69,7.41 27.81,8.38 27.94,8.51 29.08,8.64 29.46,9.02 29.46,11.05 28.96,11.56 | U1.42 28.67,11.56 28.96,11.56 | 30.35,13.08 30.61,13.08 | 28.96,11.56 29.46,11.56 30.86,10.16 30.99,10.16 | 30.99,10.16 31.5,10.16 32.51,11.18 32.38,11.68 31.12,12.95 | v30.99,8.89 30.9,9.67 | 30.9,9.67 30.86,10.03 30.99,10.16 | v30.23,9.65 v30.99,9.65 30.92,9.65 30.9,9.67 | v30.23,8.89 v30.99,8.89 | U1.18 30.99,8.54 v30.99,8.89 | 38.52,4.68 38.5,4.7 37.46,4.7 37.08,4.32 37.08,3.94 | 38.52,4.68 38.63,4.57 38.99,4.57 | 38.61,3.78 38.61,4.57 | 38.61,3.78 38.99,4.16 v38.99,4.44
  Route2 0.254: v65.66,5.84 61.85,9.65 v61.34,9.65 v61.85,13.34 62.48,13.21 62.74,13.46 63.75,13.46 v64.39,14.1 | v47.12,4.7 46.86,4.44 46.61,4.44 43.05,8 v41.91,8 43.56,9.65 v47.12,9.78 47.12,15.62 v48.13,16.64 49.02,17.53 v50.93,17.53 51.05,13.84 TX/RX.EXP@1 TX/RX.EXP@2 TX/RX.EXP@3 TX/RX.EXP@6 | v42.04,17.91 42.04,16.13 41.02,15.11 39.12,15.11 38.99,15.24 JP1.3 | v19.3,3.81 17.27,3.81 v16.51,2.92 v14.99,1.4 11.94,1.4 10.41,2.92 10.41,5.21 13.08,7.87 13.21,7.87 13.59,8.26 | v8.51,17.91 8.51,15.49 v10.41,13.59 | 13.59,8.26 13.59,9.14 v13.46,9.27 | v16.76,6.48 16.13,7.11 16.13,8.76 15.62,9.27 v14.73,9.27 | v16.51,13.08 16.76,13.34 20.57,13.34 21.21,13.97 21.21,14.61 20.7,15.11 v20.7,15.75 | v34.16,1.27 34.16,3.94 | 34.16,3.94 34.16,5.71 v30.99,8.89 | v38.99,4.44 38.48,3.94 34.16,3.94 | TX/RX.EXP@6 TX/RX.EXP@5 | TX/RX.EXP@6 TX/RX.EXP@9 | TX/RX.EXP@7 TX/RX.EXP@8 52.98,10.92 52.96,10.92 53.09,11.05 TX/RX.EXP@5 | TX/RX.EXP@4 TX/RX.EXP@5 | 13.59,8.26 11.94,9.91 v11.3,9.91
  Bottom 0.254: 35.18,2.03 35.56,2.54 39.12,2.54 39.5,3.05 C16.2 40.27,4.57 40.64,4.57 41.15,4.95 41.15,7.37 41.78,8 v41.91,8 | 35.18,2.03 35.18,1.35 U$7.P$3 | 35.18,2.03 34.92,2.03 v34.16,1.27 | JP4.MT2 65.42,17.65 JP4.GND 62.74,14.97 62.74,13.46 62.48,13.21 v61.85,13.34 | JP4.MT1 56.83,18.29 v56.13,18.29 | v48.13,16.64 48.13,16.89 | U4.P$3 20.7,17.08 v20.7,15.75 | v19.3,3.81 19.13,3.64 U4.P$19 | v11.3,9.91 10.3,8.91 JP5.GND 5.32,9.65 v1.9,9.65 | U$2.GND 7.87,17.91 v8.51,17.91 | v29.84,3.43 29.84,2.36 U4.P$12 | R21.2 36.83,7.37 36.45,6.98 32.89,6.98 v30.99,8.89 | U4.P$8 28.19,17.09 28.19,16 27.56,15.37 v26.29,15.37 | v65.66,5.84 65.41,5.59 SG1.- 63.18,5.84 v65.66,5.84
  other vias: 6.1,7.75 9.78,3.81 18.54,10.92 46.48,12.07 40.64,13.21
  pour Top: -0.38,21.72 73.28,21.72 73.28,-1.78 -0.38,-1.78
  pour Route2: -0.38,21.72 73.28,21.72 73.28,-3.68 -0.38,-3.68
  pour Bottom: -0.38,21.72 73.28,21.72 73.28,-8.13 -0.38,-8.13
GPS_RX  (via drill 0.38)
  Top 0.254: U1.38 v28.32,14.73
  Bottom 0.254: v28.32,14.73 28.45,15.11 29.59,16.26 29.59,17.11 U4.P$9
GPS_TX  (via drill 0.38)
  Top 0.254: U1.37 29.55,14.56 v29.84,14.86
  Bottom 0.254: v29.84,14.86 29.97,14.86 30.99,15.88 30.99,17.01 U4.P$10
LED  (via drill 0.38)
  Top 0.254: v31.62,11.43 30.92,11.43 U1.39
  Bottom 0.254: D2.A 33.81,9.4 32.38,9.4 31.62,10.16 v31.62,11.43
LVD_IN
  Top 0.254: 1U2.3 9.61,8.82 U$3.D4 | U$3.D4 U$3.D3 U$3.D2 U$3.D1 8.13,10.73 1U2.1 | C1.1 8.06,7.14 8.06,7.62 U$3.D4 | 8,7.75 8.06,7.81 U$3.D4
  Top 1.676: JP2.P1 9.78,16 8.51,14.73 8.51,11.24 U$3.D1 | JP3.P2 11.88,3.81 8.06,7.62 | 8,7.75 7.75,8 7.75,10.16
N$1  (via drill 0.38)
  Top 0.254: R6.2 16.89,11.88 v16.89,11.18 | v12.7,11.56 12.83,11.43 U$4.4
  Bottom 0.254: v16.89,11.18 16.51,11.56 v12.7,11.56
N$2  (via drill 0.38)
  Top 0.254: v6.6,14.61 6.48,14.61 5.33,13.46 2.79,13.46 1.52,12.19 1.52,11.17 U$1.IN
  Bottom 0.254: U$2.OUT 6.92,14.93 v6.6,14.61
N$3
  Top 0.254: C6.1 23.28,5.71 Y1.P$2 23.5,6.05 U1.1
N$4
  Top 0.254: U1.2 25.02,6.87 25.02,4.57 25.27,4.32 Y1.P$1 26.08,3.13 C7.1
N$5  (via drill 0.38)
  Top 0.254: C3.1 L1.2 18.58,9.11 v18.67,9.02 | U1.6 26.7,5.71 26.03,5.71 25.78,5.97 v25.78,6.22
  Bottom 0.254: v25.78,6.22 24.89,7.11 21.21,7.11 19.3,9.02 v18.67,9.02
N$6
  Top 0.254: U1.43 26.29,13.24 26.29,13.72 C4.1 | C4.1
N$8
  Top 0.254: R7.1 16.44,8.38 U$6.4
N$9
  Top 0.254: TX/RX.17 55.46,9.31 56.9,7.87 C13.1 58.29,7.44 L5.2
N$10
  Top 0.254: C13.2 62.09,7.87 L2.1 62.34,7.31 C14.1
N$11
  Top 0.254: C14.2 63.64,7.17 L2.2 64.21,8.83 C15.1 63.97,9.51 L3.1
N$12
  Top 0.254: L4.1 L3.2 C17.1
N$13
  Top 0.254: L4.2 67.58,10.16 J$1.SIG
N$15
  Top 0.254: TX/RX.25 56.02,15.37 56.13,15.49 56.52,15.88 C23.2
N$16
  Top 0.254: C15.2 63.17,11.11 L6.2 62.6,11.29 62.1,10.79 62.1,9.4 61.47,8.76 58.8,8.76 57,10.56 TX/RX.18
N$17
  Top 0.254: L9.1 59.36,9.72 C18.1 59.22,10.65 L7.2 57.55,10.91 57.4,11.05 55.47,11.05 TX/RX.19
N$18
  Top 0.254: C18.2 60.52,11.87 L8.2 60.96,11.94 61.59,12.57 62.09,12.57 L6.1
N$19
  Top 0.254: TX/RX.20 56.77,11.56 57.55,12.33 L7.1 58.18,11.94 L8.1 59.36,12.01 C19.1
N$20
  Top 0.254: C22.1 57.66,16.58 57.66,15.62 55.6,13.56 TX/RX.24
N$21
  Top 0.254: TX/RX.23 55.99,13.06 58.42,15.49 58.42,16 58.93,16.38 58.93,16.56 C22.2
N$22
  Top 0.254: TX/RX.21 56.52,12.07 58.67,14.22 C20.1
N$23
  Top 0.254: TX/RX.26 54.34,14.71 55.37,15.75 C24.2
N$24
  Top 0.254: TX/RX.14 53.84,8.52 54.86,7.49 R16.1
N$25
  Top 0.254: TX/RX.32 49.75,14.19 49.4,13.84 48.66,13.84 R14.1
N$26
  Top 0.254: C27.2 51.94,16.13 52.83,15.24 TX/RX.29
N$27
  Top 0.254: TX/RX.30 52.34,14.97 51.82,15.49 51.18,15.49 50.67,15.88 50.67,16.76 50.42,17.02 50.11,17.02 C29.2 48.52,17.34 Y3.3
N$28
  Top 0.254: TX/RX.31 51.84,14.71 51.56,14.99 49.78,14.99 49.28,14.61 46.74,14.61 45.85,15.49 Y3.1 44.06,15.8 C28.2
N$29
  Bottom 0.254: R21.1 35.78,10.9 D2.C
N$30
  Top 0.254: D1.C R17.2
N$31  (via drill 0.38)
  Top 0.254: v23.75,16 23.63,16.12 D1.A
  Bottom 0.254: U4.P$5 23.75,17.04 v23.75,16
N$34
  Top 0.254: TX/RX.6 49.8,11.06 49.02,10.29 C32.2
N$38
  Top 0.254: C36.2 59.8,5.9 R15.1 58.53,4.83 L5.1
PROG  (via drill 0.38)
  Top 0.254: U1.10 28.13,4.32 27.56,4.32 26.92,4.7 v26.67,4.7 | R13.2 8.91,1.78 v10.29,1.78
  Bottom 0.254: S2.1 S2.2 9.92,1.89 10.03,1.78 v10.29,1.78 13.97,1.78 14.73,2.54 15.62,2.54 15.75,2.67 15.75,3.56 16.76,4.57 19.69,4.57 19.81,4.7 v26.67,4.7
RAW  (via drill 0.38)  (1 unrouted)
  Top 0.254: U$3.S3 U$3.S2 5.08,10.67 U$3.S1 | U$1.VCC 3.55,10.79 U$3.S1 | U$3.S1 5.21,10.92 5.84,11.56 v5.84,11.81 | R18.2 7.48,4.33 5.33,6.48 1.52,6.48 v1.02,6.98
  Top 0.61: v6.98,12.57 v6.48,12.07 | v6.48,12.07 6.1,12.07 v5.84,11.81 | v5.84,11.81 v5.21,11.81 | v5.21,11.81 v4.57,11.81 4.57,10.92 5.21,10.92 5.21,11.05 5.71,11.56 5.21,11.56 4.95,11.3 4.95,9.65 5.21,9.65 5.21,10.54 5.08,10.67 5.08,11.68 v5.21,11.81 | v5.84,11.81 6.22,11.81 v6.48,12.07
  Bottom 0.254: U$2.VCC 8.82,13.67 JP5.VCC 6.06,11.59 v5.84,11.81 | v1.02,6.98 1.02,10.54 2.29,11.81 v4.57,11.81
  Bottom 1.016: 4.7,11.56 5.97,11.56 6.86,12.45
SENSE_A  (via drill 0.38)
  Top 0.254: R10.2 R9.1 v18.92,14.73 | U1.7 28.58,6.88 v28.45,7.37
  Bottom 0.254: v28.45,7.37 27.69,8.26 24.26,11.68 23.11,11.68 20.07,14.73 v18.92,14.73
SENSE_B  (via drill 0.38)
  Top 0.254: R12.1 R11.2 18.23,5.33 v19.18,5.33 | v29.46,7.11 29.21,6.81 U1.8
  Bottom 0.254: v19.18,5.33 19.3,5.46 27.81,5.46 v29.46,7.11
SENSE_BAT  (via drill 0.38)
  Top 0.254: R18.1 R19.2 10.54,3.05 11.43,2.16 20.32,2.16 v22.1,3.94 | U1.11 28.33,3.81 v27.05,3.81
  Bottom 0.254: v27.05,3.81 26.8,3.94 v22.1,3.94
SPI1_MISO  (via drill 0.38)
  Top 0.254: U1.25 36.87,9.02 39.12,9.02 v40.13,10.03 | TX/RX.9 51.05,9.15 51.05,9.14 v50.04,8.13 | MEM.SO 43.31,11.18 v43.37,11.24
  Bottom 0.254: v40.13,10.03 42.16,10.03 v43.37,11.24 43.31,11.18 46.99,11.18 v50.04,8.13
SPI1_MOSI
  Top 0.254: U1.28 36.82,13.72 MEM.SI 39.12,13.72 43.81,9.02 48.64,9.02 50.18,10.56 TX/RX.7
SPI1_SCK
  Top 0.254: U1.26 36.96,12.45 MEM.SCK 38.53,12.32 39.75,12.32 43.56,8.51 49.28,8.51 50.83,10.06 TX/RX.8
SPI2_MISO
  Top 0.254: U3.12 42.16,3.12 | 42.16,3.12 41.71,3.12 41.53,3.3 41.11,3.3 U$5.6 | U1.22 35.69,6.67 35.69,4.57 37.34,2.92 37.34,1.91 37.59,1.65 41.91,1.65 42.16,1.91 42.16,3.12
SPI2_MOSI  (via drill 0.38)
  Top 0.254: U1.23 35.82,7.24 38.99,7.24 39.62,6.6 39.62,5.33 40.27,4.82 U$5.7 41.79,4.94 v41.91,4.7 | v42.8,1.4 42.8,1.77 U3.13
  Bottom 0.254: v41.91,4.7 41.91,2.29 v42.8,1.4
SPI2_SCK  (via drill 0.38)
  Top 0.254: U1.24 35.99,8.21 36.32,7.87 39.17,7.87 40.51,6.48 40.72,6.27 U$5.8 41.81,6.19 v41.91,6.1 | v45.21,1.27 44.7,1.27 44.58,1.4 44.58,2.09 U3.14
  Bottom 0.254: v41.91,6.1 43.43,6.1 44.45,5.08 44.45,2.03 v45.21,1.27
SWCLK  (via drill 0.38)
  Top 0.254: v28.32,10.29 27.82,10.29 U1.45
  Bottom 0.254: JP1.4 38.99,18.16 38.73,18.41 34.67,18.41 34.16,17.91 34.16,16.13 v28.32,10.29
SWDIO  (via drill 0.38)
  Top 0.254: v28.19,9.27 28.13,9.27 U1.46
  Bottom 0.254: JP1.2 40.89,17.53 41.27,17.14 41.27,15.88 40.64,15.24 34.04,15.24 29.21,10.41 29.21,9.78 28.7,9.27 v28.19,9.27
USB_D+  (via drill 0.38)
  Top 0.254: U1.34 33.59,14.73 34.54,14.73 34.67,14.61 v35.05,13.84
  Bottom 0.254: v35.05,13.84 35.18,13.97 56.9,13.97 57.53,13.34 60.71,13.34 61.47,14.1 JP4.D+
USB_D-  (via drill 0.38)
  Top 0.254: U1.33 33.54,13.97 v33.91,13.97
  Bottom 0.254: v33.91,13.97 34.67,14.61 57.15,14.61 57.91,13.84 60.45,13.84 60.83,14.22 60.82,14.24 JP4.D-

### Text on the board
tNames: SAM D21g
bNames: SaLFrostburn / V1.1